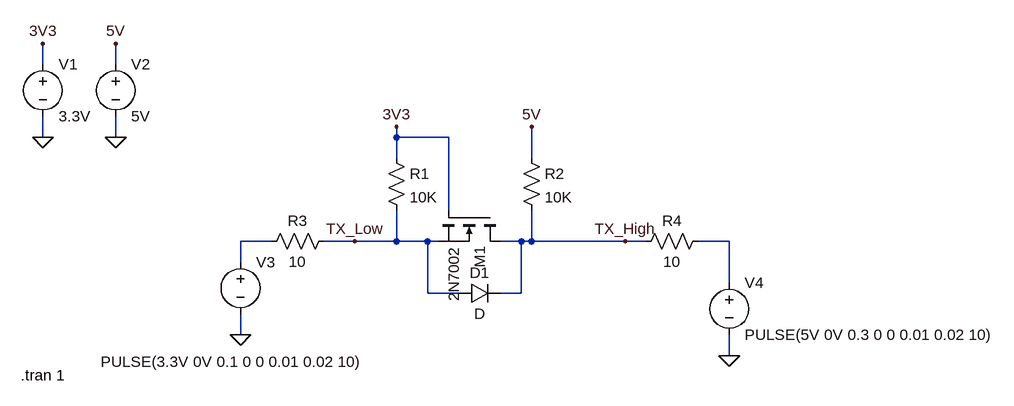
[diagram p0: schematic Draft1.asc]
Draft1.asc, the LTspice schematic file:
Version 4
SHEET 1 1116 680
WIRE -368 -64 -368 -96
WIRE -256 -64 -256 -96
WIRE -368 48 -368 16
WIRE -256 48 -256 16
WIRE 176 48 176 32
WIRE 256 48 176 48
WIRE 176 80 176 48
WIRE 384 80 384 32
WIRE 256 160 256 48
WIRE -16 208 -64 208
WIRE 112 208 64 208
WIRE 176 208 176 160
WIRE 176 208 112 208
WIRE 224 208 176 208
WIRE 240 208 224 208
WIRE 368 208 336 208
WIRE 384 208 384 160
WIRE 384 208 368 208
WIRE 528 208 384 208
WIRE 560 208 528 208
WIRE 688 208 640 208
WIRE -64 240 -64 208
WIRE 688 272 688 208
WIRE 224 288 224 208
WIRE 272 288 224 288
WIRE 368 288 368 208
WIRE 368 288 336 288
WIRE -64 352 -64 320
WIRE 688 384 688 352
FLAG 176 32 3V3
FLAG 384 32 5V
FLAG 112 208 TX_Low
FLAG 528 208 TX_High
FLAG -368 48 0
FLAG -256 48 0
FLAG -64 352 0
FLAG 688 384 0
FLAG -368 -96 3V3
FLAG -256 -96 5V
SYMBOL nmos 336 160 R90
SYMATTR InstName M1
SYMATTR Value 2N7002
SYMBOL res 160 64 R0
SYMATTR InstName R1
SYMATTR Value 10K
SYMBOL res 368 64 R0
SYMATTR InstName R2
SYMATTR Value 10K
SYMBOL voltage -368 -80 R0
WINDOW 123 0 0 Left 0
WINDOW 39 0 0 Left 0
SYMATTR InstName V1
SYMATTR Value 3.3V
SYMBOL voltage -256 -80 R0
WINDOW 123 0 0 Left 0
WINDOW 39 0 0 Left 0
SYMATTR InstName V2
SYMATTR Value 5V
SYMBOL voltage -64 224 R0
WINDOW 3 -215 169 Left 2
WINDOW 123 0 0 Left 0
WINDOW 39 0 0 Left 0
SYMATTR InstName V3
SYMATTR Value PULSE(3.3V 0V 0.1 0 0 0.01 0.02 10)
SYMBOL voltage 688 256 R0
WINDOW 123 0 0 Left 0
WINDOW 39 0 0 Left 0
SYMATTR InstName V4
SYMATTR Value PULSE(5V 0V 0.3 0 0 0.01 0.02 10)
SYMBOL diode 272 304 R270
WINDOW 0 32 32 VTop 2
WINDOW 3 0 32 VBottom 2
SYMATTR InstName D1
SYMBOL res 80 192 R90
WINDOW 0 0 56 VBottom 2
WINDOW 3 32 56 VTop 2
SYMATTR InstName R3
SYMATTR Value 10
SYMBOL res 656 192 R90
WINDOW 0 0 56 VBottom 2
WINDOW 3 32 56 VTop 2
SYMATTR InstName R4
SYMATTR Value 10
TEXT -402 414 Left 2 !.tran 1

The netlist it stands for:
* Draft1.asc
M1 TX_High 3V3 TX_Low TX_Low 2N7002
R1 3V3 TX_Low 10K
R2 5V TX_High 10K
V1 3V3 0 3.3V
V2 5V 0 5V
V3 N001 0 PULSE(3.3V 0V 0.1 0 0 0.01 0.02 10)
V4 N002 0 PULSE(5V 0V 0.3 0 0 0.01 0.02 10)
D1 TX_Low TX_High D
R3 TX_Low N001 10
R4 N002 TX_High 10
.model D D
.lib standard.dio
.model NMOS NMOS
.model PMOS PMOS
.lib standard.mos
.tran 1
.backanno
.end

* Results of the author's LTspice run, read from the files saved beside the schematic
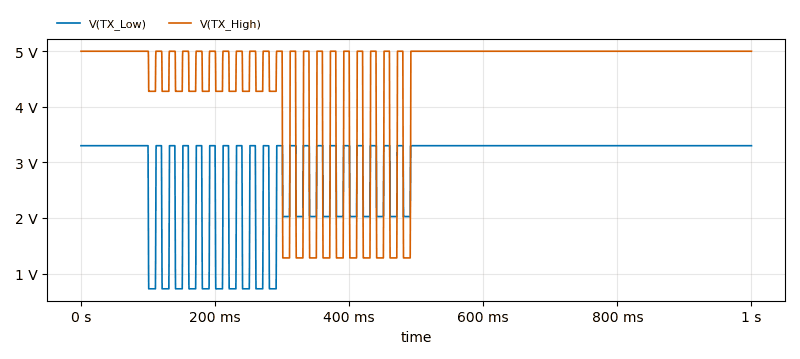
[diagram p1: Transient Analysis of Draft1.asc, plotted from the saved traces]
* Transient Analysis, 1 run:
*   V(TX_Low): min 724 mV, max 3.3 V, average 2.879 V, rms 3 V, last 3.3 V
*   V(TX_High): min 1.28 V, max 5 V, average 4.509 V, rms 4.653 V, last 5 V